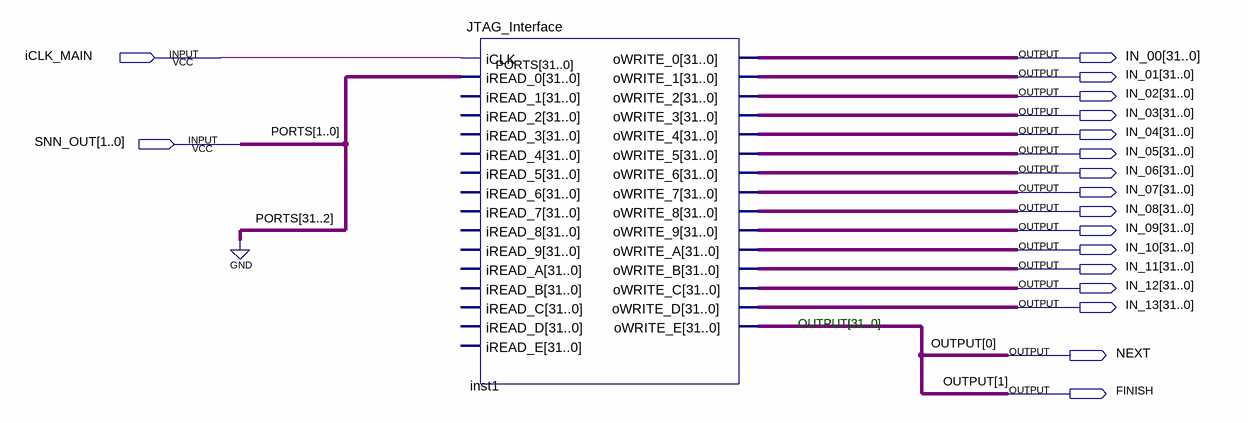
[diagram p0: schematic sheet]
// Quartus schematic MyDesign.bdf as structural Verilog: 1 symbols, 18 pins
module MyDesign (
  input  iCLK_MAIN,
  input  [1:0] SNN_OUT,
  output [31:0] IN_00,
  output [31:0] IN_01,
  output [31:0] IN_02,
  output [31:0] IN_03,
  output [31:0] IN_04,
  output [31:0] IN_05,
  output [31:0] IN_06,
  output [31:0] IN_07,
  output [31:0] IN_08,
  output [31:0] IN_09,
  output [31:0] IN_10,
  output [31:0] IN_11,
  output [31:0] IN_12,
  output [31:0] IN_13,
  output NEXT,
  output FINISH
);

  wire [31:2] OUTPUT;

  JTAG_Interface inst1 (
    .iCLK(iCLK_MAIN), .iREAD_0({{30{1'b0}}, SNN_OUT}), .oWRITE_0(IN_00), .oWRITE_1(IN_01), .oWRITE_2(IN_02),
    .oWRITE_3(IN_03), .oWRITE_4(IN_04), .oWRITE_5(IN_05), .oWRITE_6(IN_06), .oWRITE_7(IN_07),
    .oWRITE_8(IN_08), .oWRITE_9(IN_09), .oWRITE_A(IN_10), .oWRITE_B(IN_11), .oWRITE_C(IN_12),
    .oWRITE_D(IN_13), .oWRITE_E({OUTPUT, FINISH, NEXT}));  // open: iREAD_1, iREAD_2, iREAD_3, iREAD_4, iREAD_5, iREAD_6, iREAD_7, iREAD_8, iREAD_9, iREAD_A, iREAD_B, iREAD_C, iREAD_D, iREAD_E

  // Other names for the same wires on the sheet: OUTPUT[1:0] = {FINISH, NEXT}; PORTS[1:0] = SNN_OUT

  // Notes on the sheet:
  //   OUTPUT[31..0]
endmodule
